# EasyEDA Pro project BLEhound.epro, board blehound
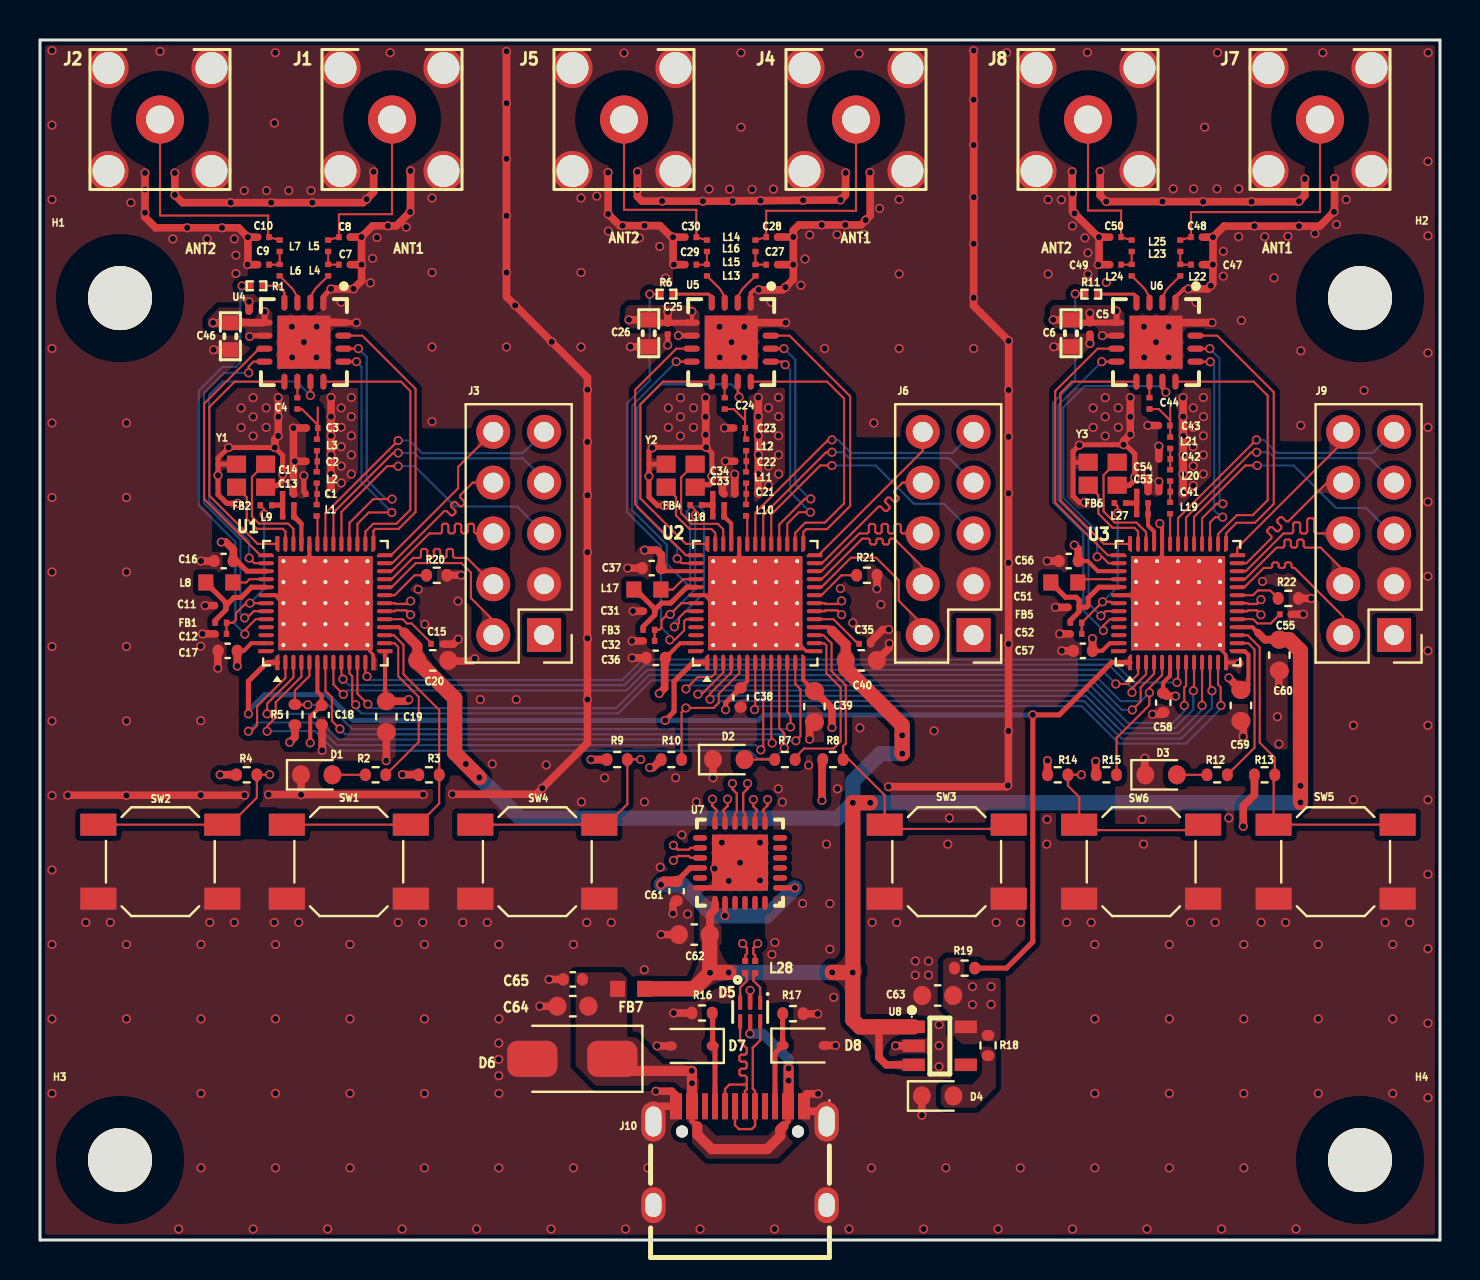
[diagram p1: board, top side]
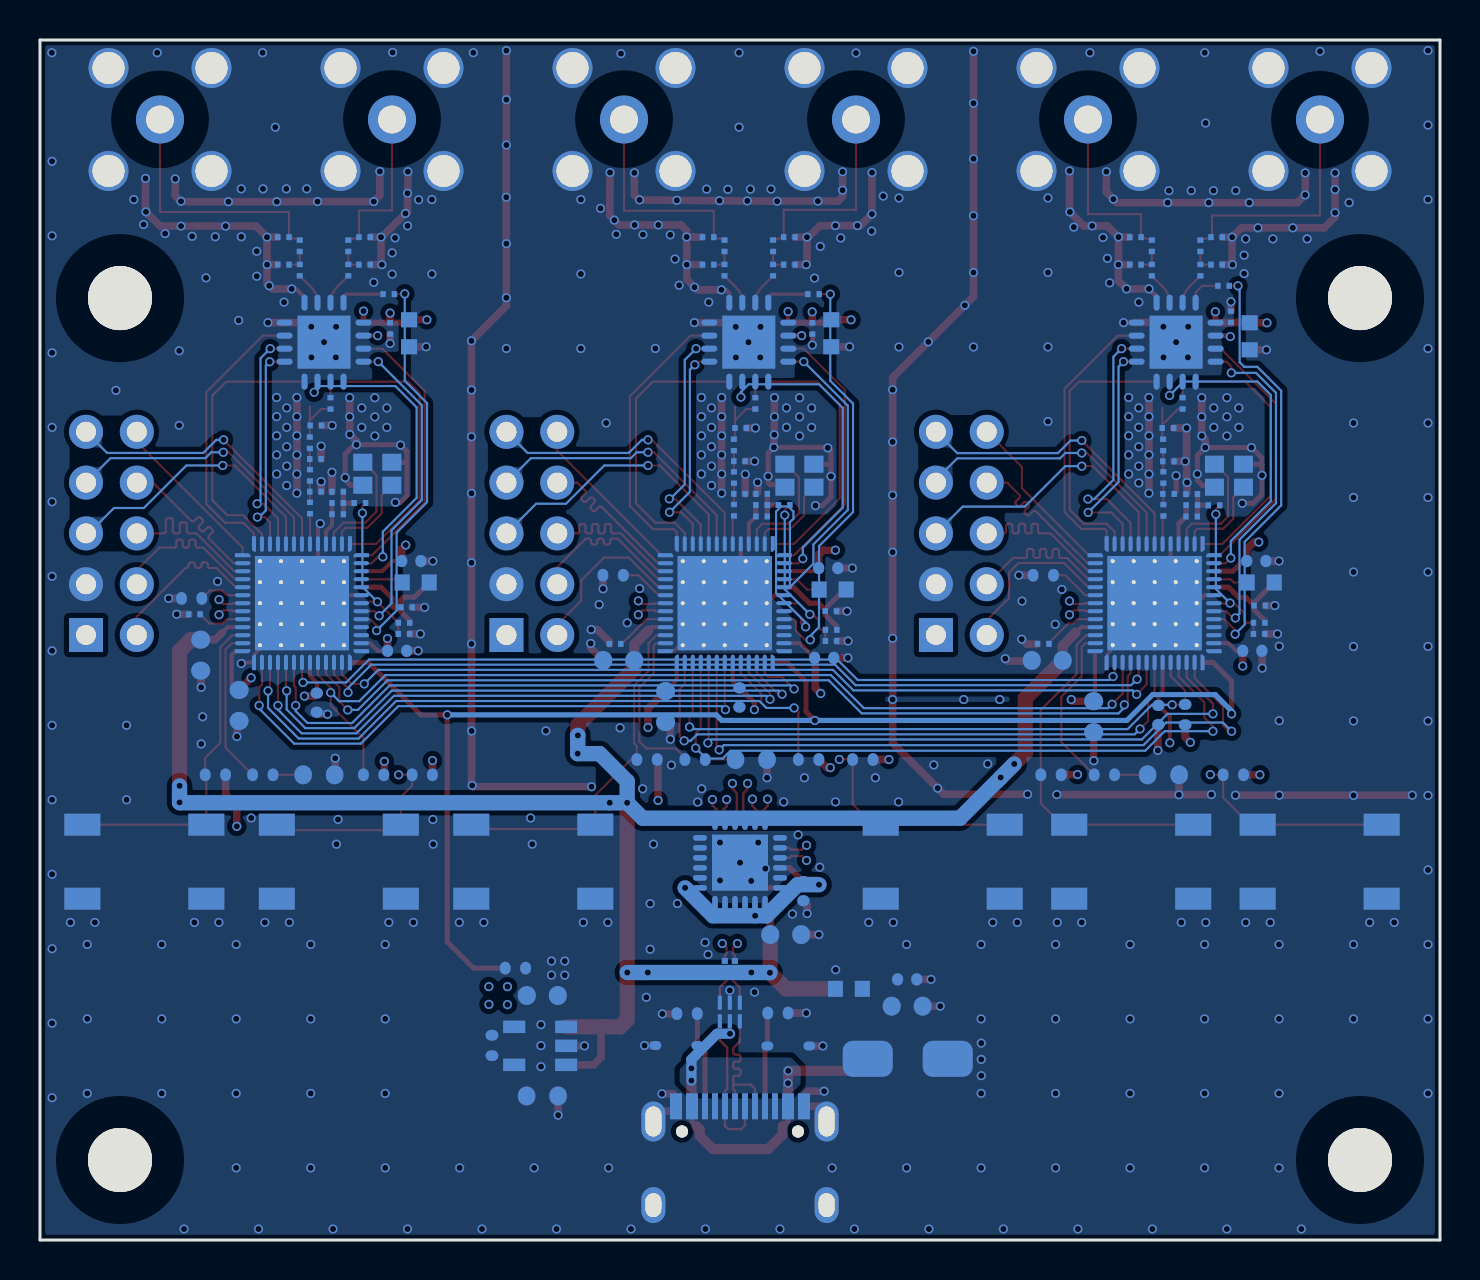
[diagram p2: board, bottom side, seen from below]

Outline 70 x 60 mm; copper layers: Top Layer, GND.Plane, Sig.Mid1, Sig.Mid2, PWR.Plane, Bottom Layer. Coordinates in mm from the lower left corner of the outline.
Outline path: 0,60 70,60 70,0 0,0 0,60
Stack: Top Layer 0.035mm / Bottom Layer 0.035mm

## Design rules (mm)
net FMID1B: 50
net RFO2C: 50
net TRXC: 50
net FANT1B: 50
net FANT2B: 50
net TRXB: 50
net FANT1C: 50
net FMID1C: 50
net TRXA: 50
net RFO1A: 50
net RFO1B: 50
net RFO2A: 50
net RFO2B: 50
net RFO1C: 50
net FANT2C: 50
net FMID2B: 50
net FANT1A: 50
net FMID1A: 50
net FANT2A: 50
net FMID2A: 50
net FMID2C: 50
net GND: PWR
net +3V3: PWR
net ANT3C: 50
net ANT4C: 50
net ANT2C: 50
net ANT2A: 50
net ANT3A: 50
net USB_ESD_DP: 90, DP6
net USB_ESD_DM: 90, DP6
net USB_CON_DM: 90, DP5
net USB_CON_DP: 90, DP5
net ANT4B: 50
net +5V: PWR
net ANT2B: 50
net ANT3B: 50
net ANT4A: 50
net TCLKC: TCLK
net ANT1C: 50
net TCLKB: TCLK
net ANT1A: 50
net USBC_DP: 90, DP3
net USBC_DM: 90, DP3
net ANT1B: 50
net USB_UP_DP: 90, DP4
net USB_UP_DM: 90, DP4
net USBA_DP: 90, DP1
net USBA_DM: 90, DP1
net TCLKA: TCLK
net TD0A: TD
net TD1A: TD
net TD2A: TD
net TD3A: TD
net USBB_DP: 90, DP2
net USBB_DM: 90, DP2
spacing copperThickness1oz (default): track to track 0.152, other pairs 0.152 to 0.3
track width copperThickness1oz (default): min 0.102, default 0.107, max 2.54
track width PWR: min 0.127, default 0.381, max 2.54
differential pair 9: width min 0.127, default 2.54, max 2.54; gap min 0.127, default 0.152
differential pair 90 (default): width min 0.102, default 0.117, max 2.54; gap min 0.152, default 0.203
net +3V3 uses PWR, copperRegion
net +5V uses PWR, copperRegion
net GND uses PWR, copperRegion
net class PWR uses PWR
net VBUS_CON uses copperRegion
net PWRLED uses copperRegion

## Placement (name value [footprint] x y rotation side)
C1  1.2pF  [nRF54LM20A:DK_C_0201_0603Metric]  13.57 37.3 180 top
C2  1.5pF  [nRF54LM20A:DK_C_0201_0603Metric]  13.58 38.93 180 top
C3  0.3pF  [nRF54LM20A:DK_C_0201_0603Metric]  13.6 40.6 180 top
C4  1.0pF  [nRF54LM20A:DK_C_0201_0603Metric]  12.87 41.83 90 top
C5  100nF  [nRF54LM20A:DK_C_0201_0603Metric]  52.5 45.58 270 top
C6  10uF  [nRF54LM20A:DK_C_0402_1005Metric]  51.55 45.34 270 top
C7  2.0pF  [nRF54LM20A:DK_C_0201_0603Metric]  15.23 48.77 180 top
C8  1.0pF  [nRF54LM20A:DK_C_0201_0603Metric]  15.23 50.14 180 top
C9  2.0pF  [nRF54LM20A:DK_C_0201_0603Metric]  11.17 48.77 0 top
C10  1.0pF  [nRF54LM20A:DK_C_0201_0603Metric]  11.17 50.14 0 top
C11  4.7uF  [nRF54LM20A:DK_C_0201_0603Metric]  9.01 31.72 180 top
C12  2.2uF  [nRF54LM20A:DK_C_0201_0603Metric]  9.04 30.3 180 top
C13  1.0pF  [nRF54LM20A:DK_C_0201_0603Metric]  12.41 36.74 180 top
C14  2.2uF  [nRF54LM20A:DK_C_0201_0603Metric]  12.41 37.3 0 top
C15  2.2uF  [nRF54LM20A:DK_C_0201_0603Metric]  19.84 29.81 0 top
C16  100nF  [Capacitor_SMD:C_0402_1005Metric]  9.18 33.95 180 top
C17  100nF  [Capacitor_SMD:C_0402_1005Metric]  9.39 29.46 180 top
C18  100nF  [Capacitor_SMD:C_0402_1005Metric]  14.08 26.25 270 top
C19  10uF  [Capacitor_SMD:C_0603_1608Metric]  17.32 26.16 270 top
C20  4.7uF  [Capacitor_SMD:C_0603_1608Metric]  19.64 28.98 0 top
C21  1.2pF  [nRF54LM20A:DK_C_0201_0603Metric]  35.03 37.31 180 top
C22  1.5pF  [nRF54LM20A:DK_C_0201_0603Metric]  35.03 38.94 180 top
C23  0.3pF  [nRF54LM20A:DK_C_0201_0603Metric]  34.97 40.6 180 top
C24  1.0pF  [nRF54LM20A:DK_C_0201_0603Metric]  34.24 41.83 90 top
C25  100nF  [nRF54LM20A:DK_C_0201_0603Metric]  31.38 45.58 270 top
C26  10uF  [nRF54LM20A:DK_C_0402_1005Metric]  30.44 45.34 270 top
C27  2.0pF  [nRF54LM20A:DK_C_0201_0603Metric]  36.59 48.77 180 top
C28  1.0pF  [nRF54LM20A:DK_C_0201_0603Metric]  36.59 50.14 180 top
C29  2.0pF  [nRF54LM20A:DK_C_0201_0603Metric]  32.53 48.77 0 top
C30  1.0pF  [nRF54LM20A:DK_C_0201_0603Metric]  32.53 50.14 0 top
C31  4.7uF  [nRF54LM20A:DK_C_0201_0603Metric]  30.45 31.44 180 top
C32  2.2uF  [nRF54LM20A:DK_C_0201_0603Metric]  30.44 29.95 180 top
C33  1.0pF  [nRF54LM20A:DK_C_0201_0603Metric]  33.92 36.75 180 top
C34  2.2uF  [nRF54LM20A:DK_C_0201_0603Metric]  33.92 37.31 0 top
C35  2.2uF  [nRF54LM20A:DK_C_0201_0603Metric]  41.24 29.81 0 top
C36  100nF  [Capacitor_SMD:C_0402_1005Metric]  30.79 29.11 180 top
C37  100nF  [Capacitor_SMD:C_0402_1005Metric]  30.59 33.6 180 top
C38  100nF  [Capacitor_SMD:C_0402_1005Metric]  35.03 27.13 270 top
C39  10uF  [Capacitor_SMD:C_0603_1608Metric]  38.72 26.67 270 top
C40  4.7uF  [Capacitor_SMD:C_0603_1608Metric]  41.06 28.98 0 top
C41  1.2pF  [nRF54LM20A:DK_C_0201_0603Metric]  56.23 37.42 180 top
C42  1.5pF  [nRF54LM20A:DK_C_0201_0603Metric]  56.23 39.05 180 top
C43  0.3pF  [nRF54LM20A:DK_C_0201_0603Metric]  56.21 40.73 180 top
C44  1.0pF  [nRF54LM20A:DK_C_0201_0603Metric]  55.47 41.83 90 top
C45  100nF  [nRF54LM20A:DK_C_0201_0603Metric]  10.45 46.16 90 top
C46  10uF  [nRF54LM20A:DK_C_0402_1005Metric]  9.52 45.19 270 top
C47  2.0pF  [nRF54LM20A:DK_C_0201_0603Metric]  57.83 48.77 180 top
C48  1.0pF  [nRF54LM20A:DK_C_0201_0603Metric]  57.83 50.14 180 top
C49  2.0pF  [nRF54LM20A:DK_C_0201_0603Metric]  53.77 48.77 0 top
C50  1.0pF  [nRF54LM20A:DK_C_0201_0603Metric]  53.77 50.14 0 top
C51  4.7uF  [nRF54LM20A:DK_C_0201_0603Metric]  51.67 31.64 180 top
C52  2.2uF  [nRF54LM20A:DK_C_0201_0603Metric]  51.8 30.3 180 top
C53  1.0pF  [nRF54LM20A:DK_C_0201_0603Metric]  55.12 36.85 180 top
C54  2.2uF  [nRF54LM20A:DK_C_0201_0603Metric]  55.12 37.41 0 top
C55  2.2uF  [nRF54LM20A:DK_C_0201_0603Metric]  62.28 31.29 0 top
C56  100nF  [Capacitor_SMD:C_0402_1005Metric]  51.43 33.95 180 top
C57  100nF  [Capacitor_SMD:C_0402_1005Metric]  52.14 29.46 180 top
C58  100nF  [Capacitor_SMD:C_0402_1005Metric]  56.16 26.87 270 top
C59  10uF  [Capacitor_SMD:C_0603_1608Metric]  60.04 26.73 270 top
C60  4.7uF  [Capacitor_SMD:C_0603_1608Metric]  61.97 29.24 270 top
C61  1uF  [Capacitor_SMD:C_0402_1005Metric]  31.83 17.44 270 top
C62  1uF  [Capacitor_SMD:C_0603_1608Metric]  32.71 15.27 180 top
C63  10uF  [Capacitor_SMD:C_0603_1608Metric]  44.88 12.22 180 top
C64  1uF  [Capacitor_SMD:C_0603_1608Metric]  26.64 11.69 180 top
C65  100nF  [Capacitor_SMD:C_0402_1005Metric]  26.64 13.03 180 top
D1  GREEN  [LED_SMD:LED_0603_1608Metric]  13.83 23.26 0 top
D2  GREEN  [LED_SMD:LED_0603_1608Metric]  34.44 24.02 0 top
D3  GREEN  [LED_SMD:LED_0603_1608Metric]  56.06 23.26 0 top
D4  PWR  [LED_SMD:LED_0603_1608Metric]  44.88 7.2 0 top
D5  PRTR5V0U2F  [nordic:SON50P100X50-6N]  35.51 11.4 270 top
D6  SMAJ5.0A  [Diode_SMD:D_SMA]  26.61 9.06 180 top
D7  PESD5V0S1BA  [Diode_SMD:D_SOD-323]  32.58 9.7 180 top
D8  PESD5V0S1BA  [Diode_SMD:D_SOD-323]  38.18 9.72 0 top
FB1  120R  [nRF54LM20A:DK_L_0201_0603Metric]  9.04 30.86 0 top
FB2  15nH  [nRF54LM20A:DK_L_0201_0603Metric]  11.3 36.73 0 top
FB3  120R  [nRF54LM20A:DK_L_0201_0603Metric]  30.44 30.51 0 top
FB4  15nH  [nRF54LM20A:DK_L_0201_0603Metric]  32.79 36.75 0 top
FB5  120R  [nRF54LM20A:DK_L_0201_0603Metric]  51.8 30.86 0 top
FB6  15nH  [nRF54LM20A:DK_L_0201_0603Metric]  54.01 36.85 0 top
FB7  120R/3A  [nordic:INDC1608X06L]  29.56 12.56 0 top
H1  M3  [MountingHole_3.2mm_M3]  4 47.09 0 top
H2  M3  [MountingHole_3.2mm_M3]  66 47.09 0 top
H3  M3  [MountingHole_3.2mm_M3]  4 4 0 top
H4  M3  [MountingHole_3.2mm_M3]  66 4 0 top
J1  PCB.SMAFRA.HT  [nordic:SMA_RA_TH_Taoglas]  17.6 56.03 0 top
J2  PCB.SMAFRA.HT  [nordic:SMA_RA_TH_Taoglas]  6 56.03 0 top
J3  SWD+ETM ch37  [Connector_PinHeader_2.54mm:PinHeader_2x05_P2.54mm_Vertical]  25.2 30.25 180 top
J4  PCB.SMAFRA.HT  [nordic:SMA_RA_TH_Taoglas]  40.8 56.03 0 top
J5  PCB.SMAFRA.HT  [nordic:SMA_RA_TH_Taoglas]  29.2 56.03 0 top
J6  SWD+ETM ch38  [Connector_PinHeader_2.54mm:PinHeader_2x05_P2.54mm_Vertical]  46.68 30.25 180 top
J7  PCB.SMAFRA.HT  [nordic:SMA_RA_TH_Taoglas]  64 56.03 0 top
J8  PCB.SMAFRA.HT  [nordic:SMA_RA_TH_Taoglas]  52.4 56.03 0 top
J9  SWD+ETM ch39  [Connector_PinHeader_2.54mm:PinHeader_2x05_P2.54mm_Vertical]  67.7 30.25 180 top
J10  USB-C  [ext:USB-C_SMD-TYPE-C-31-M-12_1]  35 4.22 0 top
L1  3.6nH  [nRF54LM20A:DK_L_0201_0603Metric]  13.83 36.49 90 top
L2  4.7nH  [nRF54LM20A:DK_L_0201_0603Metric]  13.83 38.12 90 top
L3  3.3nH  [nRF54LM20A:DK_L_0201_0603Metric]  13.84 39.75 90 top
L4  1.9nH  [nRF54LM20A:DK_L_0201_0603Metric]  14.41 48.49 90 top
L5  3.0nH  [nRF54LM20A:DK_L_0201_0603Metric]  14.41 49.71 90 top
L6  1.9nH  [nRF54LM20A:DK_L_0201_0603Metric]  11.98 48.49 90 top
L7  3.0nH  [nRF54LM20A:DK_L_0201_0603Metric]  11.98 49.71 90 top
L8  4.7uH  [nRF54LM20A:DK_L_0603_1608Metric]  8.96 32.88 180 top
L9  1.0nH  [nRF54LM20A:DK_L_0201_0603Metric]  12.42 36.18 0 top
L10  3.6nH  [nRF54LM20A:DK_L_0201_0603Metric]  35.3 36.49 90 top
L11  4.7nH  [nRF54LM20A:DK_L_0201_0603Metric]  35.3 38.12 90 top
L12  3.3nH  [nRF54LM20A:DK_L_0201_0603Metric]  35.31 39.75 90 top
L13  1.9nH  [nRF54LM20A:DK_L_0201_0603Metric]  35.77 48.49 90 top
L14  3.0nH  [nRF54LM20A:DK_L_0201_0603Metric]  35.77 49.71 90 top
L15  1.9nH  [nRF54LM20A:DK_L_0201_0603Metric]  33.35 48.49 90 top
L16  3.0nH  [nRF54LM20A:DK_L_0201_0603Metric]  33.35 49.71 90 top
L17  4.7uH  [nRF54LM20A:DK_L_0603_1608Metric]  30.37 32.52 180 top
L18  1.0nH  [nRF54LM20A:DK_L_0201_0603Metric]  33.92 36.18 0 top
L19  3.6nH  [nRF54LM20A:DK_L_0201_0603Metric]  56.5 36.6 90 top
L20  4.7nH  [nRF54LM20A:DK_L_0201_0603Metric]  56.5 38.23 90 top
L21  3.3nH  [nRF54LM20A:DK_L_0201_0603Metric]  56.51 39.86 90 top
L22  1.9nH  [nRF54LM20A:DK_L_0201_0603Metric]  57.01 48.49 90 top
L23  3.0nH  [nRF54LM20A:DK_L_0201_0603Metric]  57.01 49.71 90 top
L24  1.9nH  [nRF54LM20A:DK_L_0201_0603Metric]  54.58 48.49 90 top
L25  3.0nH  [nRF54LM20A:DK_L_0201_0603Metric]  54.58 49.71 90 top
L26  4.7uH  [nRF54LM20A:DK_L_0603_1608Metric]  51.22 32.88 180 top
L27  1.0nH  [nRF54LM20A:DK_L_0201_0603Metric]  55.12 36.29 0 top
L28  DLM0NSM900HY2D  [nordic:CMC0806X05N]  35.51 13.65 0 top
R1  33k  [nRF54LM20A:DK_R_0201_0603Metric]  10.82 47.71 0 top
R2  1k  [Resistor_SMD:R_0402_1005Metric]  16.78 23.26 180 top
R3  10k  [Resistor_SMD:R_0402_1005Metric]  19.45 23.26 0 top
R4  10k  [Resistor_SMD:R_0402_1005Metric]  10.33 23.26 0 top
R5  10k  [Resistor_SMD:R_0402_1005Metric]  12.74 26.27 90 top
R6  33k  [nRF54LM20A:DK_R_0201_0603Metric]  31.32 47.29 0 top
R7  1k  [Resistor_SMD:R_0402_1005Metric]  37.25 24.02 180 top
R8  10k  [Resistor_SMD:R_0402_1005Metric]  39.65 24.02 0 top
R9  10k  [Resistor_SMD:R_0402_1005Metric]  28.86 24.02 0 top
R10  10k  [Resistor_SMD:R_0402_1005Metric]  31.57 24.02 0 top
R11  33k  [nRF54LM20A:DK_R_0201_0603Metric]  52.56 47.29 0 top
R12  1k  [Resistor_SMD:R_0402_1005Metric]  58.86 23.26 180 top
R13  10k  [Resistor_SMD:R_0402_1005Metric]  61.23 23.26 0 top
R14  10k  [Resistor_SMD:R_0402_1005Metric]  50.89 23.26 0 top
R15  10k  [Resistor_SMD:R_0402_1005Metric]  53.32 23.26 0 top
R16  5.1k  [Resistor_SMD:R_0402_1005Metric]  33.1 11.35 180 top
R17  5.1k  [Resistor_SMD:R_0402_1005Metric]  37.65 11.32 0 top
R18  1k  [Resistor_SMD:R_0402_1005Metric]  47.4 9.73 270 top
R19  4.7k  [Resistor_SMD:R_0402_1005Metric]  46.23 13.59 0 top
R20  200R  [Resistor_SMD:R_0402_1005Metric]  19.84 33.24 0 top
R21  200R  [Resistor_SMD:R_0402_1005Metric]  41.34 33.24 0 top
R22  200R  [Resistor_SMD:R_0402_1005Metric]  62.42 32.08 0 top
SW1  BOOT  [Button_Switch_SMD:SW_SPST_SKQG_WithoutStem]  15.44 18.92 0 top
SW2  RESET  [Button_Switch_SMD:SW_SPST_SKQG_WithoutStem]  6.02 18.92 0 top
SW3  BOOT  [Button_Switch_SMD:SW_SPST_SKQG_WithoutStem]  45.34 18.92 0 top
SW4  RESET  [Button_Switch_SMD:SW_SPST_SKQG_WithoutStem]  24.86 18.92 0 top
SW5  BOOT  [Button_Switch_SMD:SW_SPST_SKQG_WithoutStem]  64.78 18.92 0 top
SW6  RESET  [Button_Switch_SMD:SW_SPST_SKQG_WithoutStem]  55.06 18.92 0 top
U1  nRF54LM20A ch37  [nRF54LM20A:nRF54LM20A_QFN52_6x6mm_P0.4mm_EP4.7x4.7mm]  14.27 31.84 90 top
U2  nRF54LM20A ch38  [nRF54LM20A:nRF54LM20A_QFN52_6x6mm_P0.4mm_EP4.7x4.7mm]  35.76 31.84 90 top
U3  nRF54LM20A ch39  [nRF54LM20A:nRF54LM20A_QFN52_6x6mm_P0.4mm_EP4.7x4.7mm]  56.9 31.84 90 top
U4  nRF21540-QDAA  [nRF54LM20A:nRF21540_QFN16_4x4mm_P0.65mm_EP2.65]  13.19 44.89 270 top
U5  nRF21540-QDAA  [nRF54LM20A:nRF21540_QFN16_4x4mm_P0.65mm_EP2.65]  34.56 44.89 270 top
U6  nRF21540-QDAA  [nRF54LM20A:nRF21540_QFN16_4x4mm_P0.65mm_EP2.65]  55.8 44.89 270 top
U7  CH334F  [ext:QFN-24_L4.0-W4.0-P0.50-BL-EP2.8]  35 18.86 90 top
U8  AP2112K-3.3  [ext:SOT-25-5_L2.9-W1.6-P0.95-LS2.8-BL]  44.99 9.71 270 top
Y1  32MHz  [nRF54LM20A:DK_Crystal_32MHz]  10.55 38.22 180 top
Y2  32MHz  [nRF54LM20A:DK_Crystal_32MHz]  32.03 38.22 180 top
Y3  32MHz  [nRF54LM20A:DK_Crystal_32MHz]  53.13 38.31 180 top

## Footprints (pads in the part's own frame, mm; a bottom-side part is the same pattern mirrored in y, then rotated)
Button_Switch_SMD:SW_SPST_SKQG_WithoutStem
  rect 1.8x1.1 hole 0.001: 1(-3.1,1.85) 1(3.1,1.85) 2(-3.1,-1.85) 2(3.1,-1.85)
Capacitor_SMD:C_0402_1005Metric
  rrect 0.56x0.62 hole 0.001: 1(-0.48,0) 2(0.48,0)
Capacitor_SMD:C_0603_1608Metric
  rrect 0.9x0.95 hole 0.001: 1(-0.775,0) 2(0.775,0)
Connector_PinHeader_2.54mm:PinHeader_2x05_P2.54mm_Vertical
  rect 1.7x1.7 hole 1: 1(0,0)
  round 1.7 hole 1: 2(2.54,0) 3(0,-2.54) 4(2.54,-2.54) 5(0,-5.08) 6(2.54,-5.08) 7(0,-7.62) 8(2.54,-7.62) 9(0,-10.16) 10(2.54,-10.16)
Diode_SMD:D_SMA
  rrect 2.5x1.8 hole 0.001: 1(-2,0) 2(2,0)
Diode_SMD:D_SOD-323
  rrect 0.6x0.45 hole 0.001: 1(-1.05,0) 2(1.05,0)
ext:QFN-24_L4.0-W4.0-P0.50-BL-EP2.8
  oval 0.28x0.7 hole 0.001: 1(-1.25,-2) 2(-0.75,-2) 3(-0.25,-2) 4(0.25,-2) 5(0.75,-2) 6(1.25,-2) 13(1.25,2) 14(0.75,2) 15(0.25,2) 16(-0.25,2) 17(-0.75,2) 18(-1.25,2)
  oval 0.7x0.28 hole 0.001: 7(2,-1.25) 8(2,-0.75) 9(2,-0.25) 10(2,0.25) 11(2,0.75) 12(2,1.25) 19(-2,1.25) 20(-2,0.75) 21(-2,0.25) 22(-2,-0.25) 23(-2,-0.75) 24(-2,-1.25)
  rect 2.8x2.8 hole 0.001: 25(0.01,0)
ext:SOT-25-5_L2.9-W1.6-P0.95-LS2.8-BL
  rect 0.622x1.105 hole 0.001: 1(-0.95,-1.3) 2(0,-1.3) 3(0.95,-1.3) 4(0.95,1.3) 5(-0.95,1.3)
ext:USB-C_SMD-TYPE-C-31-M-12_1
  round 0.6 hole 0.6: (-2.9,1.21) (2.9,1.21)
  oval 1.2x2 hole 0.8x1.5: 1(4.33,1.71) 4(-4.33,1.71)
  oval 1.2x1.8 hole 0.8x1.2: 2(4.33,-2.47) 3(-4.33,-2.47)
  custom 0.6x1.3 hole 0.001: A1B12(-3.2,2.47) A4B9(-2.4,2.47) B1A12(3.2,2.47) B4A9(2.4,2.47)
  rect 0.3x1.3 hole 0.001: A5(-1.25,2.47) A6(-0.25,2.47) A7(0.25,2.47) A8(1.25,2.47) B5(1.75,2.47) B6(0.75,2.47) B7(-0.75,2.47) B8(-1.75,2.47)
LED_SMD:LED_0603_1608Metric
  rrect 0.875x0.95 hole 0.001: 1(-0.787,0) 2(0.787,0)
MountingHole_3.2mm_M3
  round 3.2 hole 3.2: (0,0)
nordic:CMC0806X05N
  rect 0.3x0.3 hole 0.001: 1(-0.25,-0.3) 2(0.25,-0.3) 3(0.25,0.3) 4(-0.25,0.3)
nordic:INDC1608X06L
  rect 0.75x0.8 hole 0.001: 1(-0.675,0) 2(0.675,0)
nordic:SMA_RA_TH_Taoglas
  round 2.4 hole 1.4: 1(0,0)
  round 2 hole 1.6: 2(-2.575,2.575) 2(-2.575,-2.575) 2(2.575,2.575) 2(2.575,-2.575)
nordic:SON50P100X50-6N
  rect 0.7x0.2 hole 0.001: 1(-0.465,0.5) 2(-0.465,0) 3(-0.465,-0.5) 4(0.465,-0.5) 5(0.465,0) 6(0.465,0.5)
nRF54LM20A:DK_C_0201_0603Metric
  rect 0.27x0.3 hole 0.001: 1(-0.285,0) 2(0.285,0)
nRF54LM20A:DK_C_0402_1005Metric
  rect 0.75x0.8 hole 0.001: 1(-0.675,0) 2(0.675,0)
nRF54LM20A:DK_Crystal_32MHz
  rect 0.95x0.85 hole 0.001: 1(-0.725,-0.575) 2(0.725,-0.575) 3(0.725,0.575) 4(-0.725,0.575)
nRF54LM20A:DK_L_0201_0603Metric
  rect 0.27x0.3 hole 0.001: 1(-0.285,0) 2(0.285,0)
nRF54LM20A:DK_L_0603_1608Metric
  rect 0.75x0.8 hole 0.001: 1(-0.675,0) 2(0.675,0)
nRF54LM20A:DK_R_0201_0603Metric
  rect 0.27x0.3 hole 0.001: 1(-0.285,0) 2(0.285,0)
nRF54LM20A:nRF54LM20A_QFN52_6x6mm_P0.4mm_EP4.7x4.7mm
  custom 0.775x0.2 hole 0.001: 1(-2.962,2.4) 13(-2.962,-2.4) 27(2.962,-2.4) 39(2.962,2.4)
  rrect 0.775x0.2 hole 0.001: 2(-2.962,2) 3(-2.962,1.6) 4(-2.962,1.2) 5(-2.962,0.8) 6(-2.962,0.4) 7(-2.962,0) 8(-2.962,-0.4) 9(-2.962,-0.8) 10(-2.962,-1.2) 11(-2.962,-1.6) 12(-2.962,-2) 28(2.962,-2) 29(2.962,-1.6) 30(2.962,-1.2) 31(2.962,-0.8) 32(2.962,-0.4) 33(2.962,0) 34(2.962,0.4) 35(2.962,0.8) 36(2.962,1.2) 37(2.962,1.6) 38(2.962,2)
  custom 0.2x0.775 hole 0.001: 14(-2.4,-2.962) 26(2.4,-2.962) 40(2.4,2.962) 52(-2.4,2.962)
  rrect 0.2x0.775 hole 0.001: 15(-2,-2.962) 16(-1.6,-2.962) 17(-1.2,-2.962) 18(-0.8,-2.962) 19(-0.4,-2.962) 20(0,-2.962) 21(0.4,-2.962) 22(0.8,-2.962) 23(1.2,-2.962) 24(1.6,-2.962) 25(2,-2.962) 41(2,2.962) 42(1.6,2.962) 43(1.2,2.962) 44(0.8,2.962) 45(0.4,2.962) 46(0,2.962) 47(-0.4,2.962) 48(-0.8,2.962) 49(-1.2,2.962) 50(-1.6,2.962) 51(-2,2.962)
  round 0.5 hole 0.2: 53(-2.1,2.1) 53(-2.1,1.05) 53(-2.1,0) 53(-2.1,-1.05) 53(-2.1,-2.1) 53(-1.05,2.1) 53(-1.05,1.05) 53(-1.05,0) 53(-1.05,-1.05) 53(-1.05,-2.1) 53(0,2.1) 53(0,1.05) 53(0,0) 53(0,-1.05) 53(0,-2.1) 53(1.05,2.1) 53(1.05,1.05) 53(1.05,0) 53(1.05,-1.05) 53(1.05,-2.1) 53(2.1,2.1) 53(2.1,1.05) 53(2.1,0) 53(2.1,-1.05) 53(2.1,-2.1)
  rect 4.7x4.7 hole 0.001: 53(0,0) 53(0,0)
nRF54LM20A:nRF21540_QFN16_4x4mm_P0.65mm_EP2.65
  oval 0.8x0.3 hole 0.001: 1(-1.975,0.975) 2(-1.975,0.325) 3(-1.975,-0.325) 4(-1.975,-0.975) 9(1.975,-0.975) 10(1.975,-0.325) 11(1.975,0.325) 12(1.975,0.975)
  oval 0.3x0.8 hole 0.001: 5(-0.975,-1.975) 6(-0.325,-1.975) 7(0.325,-1.975) 8(0.975,-1.975) 13(0.975,1.975) 14(0.325,1.975) 15(-0.325,1.975) 16(-0.975,1.975)
  rect 2.65x2.65 hole 0.001: 17(0,0)
Resistor_SMD:R_0402_1005Metric
  rrect 0.54x0.64 hole 0.001: 1(-0.51,0) 2(0.51,0)

## Nets
As in the schematic.

Pads without a net: J10 A8 B8; U1 49 50 52; U2 49 50 52; U3 49 50 52; U7 2 3 4 5 6 13 17 21 22 23 24; U8 4

## Via types
v1: diameter 0.457, hole 0.305, Top Layer to Bottom Layer, 691 vias

## Routing (per net, layer and track width the routed paths; a pad name or vN(x,y) marks a point on that pad's centre or on a via; arc(x,y) is an arc through that point)
+3V3: length 62.7
  Top Layer w0.203: U3.51 53.49,29.84 53.11,29.46 C57.1 ; U2.13 38.16,28.01 C39.1 ; C37.1 31.22,33.44 U2.42 ; U1.51 10.57,29.84 10.19,29.46 9.86,29.46 ; v1(32.59,46.42) 32.6,46.41 32.6,45.89 U5.5 ; v1(13.51,24.86) 13.51,26.16 14.07,26.73 C18.1 14.08,27.21 13.87,27.42 U1.6 ; U3.6 56.5,28.21 56.16,27.86 56.16,27.36 ; U2.51 32,29.84 C36.1 ; C59.1 60.21,27.5 60.42,27.71 60.42,29.26 60.24,29.44 U3.14 ; C56.1 52.39,33.95 52.9,33.44 U3.42 ; 17.25,29.44 17.25,27 C19.1 ; U2.6 35.36,27.94 C38.1 ; U6.6 v1(53.12,45.22)
  Top Layer w0.254: U1.42 10.35,33.44 9.85,33.95 C16.1 ; C38.1 34.28,26.86 v1(34.28,26.52) ; v1(10.49,45.17) 10.53,45.22 U4.6 ; U5.6 v1(31.92,45.22)
  Top Layer w0.305: C26.1 30.58,45.87 U5.5 ; v1(11.23,46.41) 11.23,45.88 U4.5 ; v1(53.82,46.45) U6.5 51.69,45.87 C6.1
  Top Layer w0.381: v1(60.16,20.68) 60.16,21.7 60.72,22.26 60.72,23.26 ; C56.1 51.91,34.55 v1(51.71,34.75) ; U4.5 10.45,45.87 ; C5.1 v1(52.5,46.35) ; v1(39.6,25.63) 39.6,26.57 C39.1 ; C19.1 18.36,26.94 v1(18.44,27.02) ; C25.1 31.38,45.87 31.39,45.87 v1(31.39,46.4) ; v1(30.23,34.49) 30.84,34.49 31.07,34.27 C37.1 ; v1(39.1,21.98) 39.1,23.98 R8.1 ; v1(59.44,28.11) 59.44,28.1 C59.1 ; v1(30.49,23.62) 30.65,23.62 31.06,24.02 ; R5.1 12.74,25.14 v1(12.48,24.88) ; R14.1 v1(50.38,23.97) ; v1(30.96,27.33) 31.23,27.59 31.23,29.07 C36.1 ; v1(56.78,27.19) 56.32,27.19 C58.1 ; C6.1 v1(50.66,46.01) ; R15.1 52.78,23.28 v1(52.78,23.93) ; C26.1 v1(29.45,46.01) ; R4.1 v1(9.01,23.26) ; 52.63,29.46 v1(52.63,30.07) ; v1(18.12,23.27) 18.93,23.27 R3.1 ; v1(8.65,45.86) C46.1 9.53,45.88 C45.1 ; v1(9.06,34.9) 9.29,34.9 9.66,34.53 C16.1 ; R9.1 v1(27.55,24.02) ; 9.86,29.46 v1(9.86,28.7)
  vias: v1(46.63,12.67) v1(46.63,11.77) v1(47.55,12.67) v1(47.55,11.78)
+5V: length 113.4
  Top Layer w0.203: 60.89,30.37 60.62,30.64 U3.17 ; 18.22,30.37 17.95,30.64 U1.17 ; U2.17 39.42,30.64 ; 39.6,30.47 39.42,30.64
  Top Layer w0.381: 60.89,30.37 61.24,30.02 C60.1 ; U8.3 42.32,8.76 41.95,9.13 41.95,10.66 ; C62.1 33.49,16.26 33.75,16.53 U7.19
  Top Layer w0.508: C40.1 40.29,29.78 39.6,30.47 ; 18.22,30.37 18.87,29.7 C20.1
  Top Layer w0.762: v1(33.5,13.36) 33.49,13.38 C62.1 ; v1(33.5,13.36) 32.7,12.56 FB7.2 ; v1(33.5,13.36) 33.52,13.38 v1(34.43,13.38) ; v1(41.51,21.86) v1(40.64,21.86) 40.64,13.38 v1(40.64,13.38) ; v1(21.97,23.12) v1(21.29,23.8) 20.74,24.36 20.74,27.08 18.87,28.95 C20.1 ; v1(40.64,13.38) v1(39.61,13.38) ; v1(40.64,13.38) 40.64,11.01 40.99,10.66 U8.1 ; v1(63.02,21.88) v1(63.02,22.71) 63.02,29.45 62.46,30.02 C60.1 ; v1(43.12,24.32) 43.11,24.33 v1(43.11,25.23) 43.11,25.74 40.29,28.56 C40.1
  Bottom Layer w0.762: v1(21.29,23.8) v1(21.97,23.12) 24,21.09 39.87,21.09 v1(40.64,21.86) ; v1(63.02,22.71) v1(63.02,21.88) 63.01,21.86 v1(41.51,21.86) v1(40.64,21.86) ; v1(40.64,21.86) 40.64,22.94 42.02,24.32 v1(43.12,24.32) 43.12,25.22 v1(43.11,25.23) ; v1(33.5,13.36) 33.52,13.38 v1(34.43,13.38) v1(39.61,13.38) v1(40.64,13.38)
GND: length 483.9
  Top Layer w0.152: U2.53 38.01,29.74 38.31,29.44 U2.14 ; U3.13 59.3,29.26 59,29.56 U3.53 ; U1.13 16.67,29.26 16.48,29.45 16.48,29.63 U1.53
  Top Layer w0.203: U3.45 54.64,32.24 54.8,32.08 U3.53 ; U6.1 56.77,47.13 57.2,47.55 v1(57.42,47.55) ; v1(55.99,35.82) 56.1,35.71 U3.35 56.1,34.19 U3.53 ; U1.53 13.47,34.19 U1.35 ; U2.53 33.26,32.24 U2.45 ; U2.35 34.96,34.19 U2.53 ; U3.13 59.88,28.88 v1(59.94,28.83) ; U1.45 11.77,32.24 U1.53 ; 35.51,11.86 v1(35.51,12.48) ; U5.1 35.53,47.34 35.7,47.51 v1(35.93,47.51)
  Top Layer w0.254: C1.2 13.19,37.4 v1(13.19,38.22) ; Y2.4 32.88,37.76 33.49,37.76 33.59,37.87 v1(33.59,38.19) 33.59,39.34 v1(33.31,39.63) 30.64,39.63 v1(30.61,39.61) 30.45,39.44 30.45,38.79 ; 51.65,38.89 51.65,39.43 v1(51.97,39.75) 51.99,39.76 v1(54.18,39.76) 54.28,39.76 54.74,39.3 v1(54.74,38.12) 54.74,38 54.48,37.74 53.86,37.74 ; 51.65,38.89 51.65,37.2 51.97,36.88 v1(52.23,36.88) ; 51.65,38.89 Y3.2 ; v1(14.55,47.55) 14.17,47.17 U4.1 ; 30.45,38.79 v1(30.45,38.18) 30.45,37.15 30.88,36.72 v1(31.23,36.72) ; 30.45,38.79 Y2.2 ; v1(34.44,17.95) 34.09,17.61 U7.18 ; 8.9,38.77 8.9,39.1 v1(9.43,39.62) v1(11.74,39.62) 12.13,39.23 v1(12.13,38.3) 12.13,37.98 11.87,37.72 11.36,37.72 Y1.4 ; 8.9,38.77 8.92,38.79 Y1.2 ; 8.9,38.77 v1(8.9,38.23) 8.9,37.27 9.34,36.83 v1(9.89,36.83) ; v1(15.82,45.87) U4.16 ; C25.2 v1(31.38,44.75)
  Top Layer w0.381: v1(20.62,22.29) 24.81,22.29 v1(25.11,22.59) 27.37,24.85 v1(27.37,27.02) v1(27.37,30.09) v1(27.37,34.39) v1(27.37,37.24) v1(27.37,39.9) v1(27.37,42.51) 27.37,43.12 v1(25.59,44.91) v1(23.76,46.73) 23.33,47.17 v1(23.33,48.38) v1(23.33,51.21) v1(23.33,54.06) v1(23.33,56.84) v1(23.33,59.43) ; C28.1 36.89,50.15 v1(37.67,50.15) ; v1(38.88,11.3) 38.17,11.3 R17.2 ; U8.2 v1(42.78,9.71) ; C60.2 61.94,28.44 v1(61.94,27.63) ; v1(10.23,22.24) v1(8.04,22.24) v1(1.39,22.24) ; v1(14.11,24.48) 14.11,25.74 C18.2 ; 31.65,50.07 31.65,48.81 v1(31.69,48.77) C29.1 ; 31.65,50.07 31,50.72 v1(30.23,50.72) 28.98,50.72 v1(28.4,51.3) 28.4,53.15 28.4,53.15 v1(28.4,53.37) ; 31.65,50.07 v1(31.65,50.14) C30.1 ; v1(14.55,42.13) v1(14.55,41.17) v1(14.55,40.21) v1(14.55,39.25) v1(14.55,38.3) v1(14.55,37.34) ; v1(11.91,42.12) v1(11.91,41.16) v1(11.91,40.2) 11.74,40.03 v1(11.74,39.62) ; v1(29.87,53.41) 29.87,53.41 v1(29.87,52.49) 29.87,52.17 30.1,51.94 v1(31.11,51.94) 33.14,51.94 v1(33.14,51.94) v1(34.63,51.95) v1(36.03,51.97) v1(38.16,51.99) v1(40.02,52) 40.28,52.26 v1(40.28,53.36) ; C57.2 v1(51.09,29.46) ; v1(33.65,23.11) D2.1 33.67,24.02 ; v1(16.68,53.41) 16.68,52.39 v1(16.33,52.04) 16.15,51.87 v1(13.62,51.87) v1(11.56,51.87) v1(9.54,51.87) 7.13,51.87 v1(6.74,52.25) v1(6.74,53.36) ; v1(33.31,39.63) 33.31,40.24 v1(33.29,40.26) 33.29,41.15 v1(33.28,41.16) v1(33.28,42.12) ; v1(46.68,59.47) v1(46.68,57.02) v1(46.68,54.75) 46.68,54.75 v1(46.68,52.14) 46.68,49.82 v1(46.68,49.82) v1(46.68,47.11) 46.68,46.71 v1(48.43,44.96) v1(48.43,42.5) v1(48.43,40.16) v1(48.43,37.34) v1(48.43,33.86) v1(48.43,29.8) 48.43,25.46 v1(48.42,25.45) 48.42,22.76 v1(48.39,22.73) 48.33,22.66 v1(42.42,22.66) ; v1(16.08,48.77) 16.07,48.77 v1(16.07,50.15) ; v1(16.08,48.77) C7.1 ; v1(16.08,48.77) 16.08,47.96 v1(15.67,47.55) v1(14.55,47.55) ; C17.2 8.89,29.44 v1(8.89,28.59) ; C21.2 34.74,37.31 v1(34.74,38.29) ; C34.2 34.12,37.39 v1(34.12,37.88) ; v1(42.44,30.52) 42.14,30.52 41.53,29.91 C35.2 ; v1(58.65,50.14) 59.2,50.69 v1(60.72,50.69) v1(62.95,50.69) 63.99,50.69 v1(64.7,51.41) 64.73,51.43 v1(64.73,53.08) ; v1(58.65,50.14) C48.1 ; v1(58.65,50.14) 58.65,48.77 v1(58.65,48.77) ; C8.1 15.52,50.15 v1(16.07,50.15) ; v1(35.21,45.66) 35.42,45.87 U5.16 v1(37.28,45.87) ; v1(19.16,22.27) 13.05,22.27 ; 13.05,22.27 v1(11.43,22.27) ; 13.05,22.27 v1(13.05,22.26) ; 13.05,22.27 13.05,23.25 D1.1 ; v1(56.44,45.66) 56.64,45.87 U6.16 v1(58.6,45.87) ; C3.2 v1(12.67,40.6) 12.67,37.9 v1(12.65,37.88) 12.65,37.35 C14.2 ; C26.2 v1(29.52,44.66) ; D4.1 v1(44.1,6.24) ; C62.2 v1(31.06,15.27) ; v1(52.95,50.14) 52.95,48.81 v1(52.91,48.77) C49.1 ; v1(52.95,50.14) C50.1 ; v1(52.95,50.14) 52.91,50.14 51.62,51.43 v1(51.62,52.34) 51.61,52.36 v1(51.61,53.42) ; R21.2 41.85,33.23 v1(41.85,32.56) ; v1(21.74,29.07) 21.62,28.95 20.42,28.95 ; v1(16.07,50.15) 16.63,50.7 v1(17.39,50.7) 17.81,50.7 v1(18.51,51.4) 18.52,51.42 v1(18.52,53.46) ; C54.2 v1(55.4,38.39) ; v1(57.42,47.55) 58.38,47.55 58.65,47.82 v1(58.65,48.77) ; v1(53.01,53.43) 53.01,52.23 v1(53.31,51.92) v1(56.12,51.92) 58.15,51.92 v1(58.16,51.91) v1(60.58,51.91) 62.93,51.91 v1(62.95,51.94) 63.24,52.22 v1(63.24,53.05) ; C31.2 v1(29.65,31.44) ; v1(37.67,50.15) 37.67,48.77 v1(37.66,48.77) ; v1(37.67,50.15) 37.67,50.48 37.94,50.75 v1(39.08,50.75) v1(40.27,50.75) 41.04,50.75 v1(41.28,50.99) 41.51,51.22 41.51,52.65 41.5,52.66 v1(41.5,53.38) ; C39.2 38.48,25.66 v1(38.48,25.04) ; v1(55.62,26.29) 56.06,26.29 C58.2 ; v1(35.92,37.34) v1(35.92,38.3) v1(35.92,39.25) v1(35.92,40.21) v1(35.92,41.17) v1(35.92,42.13) ; C9.1 v1(10.38,48.77) 10.39,48.79 v1(10.39,50.14) ; v1(17.31,23.96) 17.32,23.97 17.32,25.39 ; v1(55.24,24.09) 55.24,23.29 D3.1 ; C41.2 v1(55.94,37.92) ; C10.1 v1(10.39,50.14) ; v1(10.39,50.14) 9.93,50.61 v1(9.1,50.61) v1(7.36,50.61) 5.78,50.61 5.25,51.15 v1(5.25,52.53) v1(5.25,53.36) ; v1(57.16,42.13) v1(57.16,41.17) v1(57.16,40.21) v1(57.16,39.25) v1(57.16,38.3) v1(57.16,37.34) ; v1(54.51,42.12) v1(54.51,41.16) 54.51,41.16 v1(54.51,40.28) 54.18,39.94 v1(54.18,39.76) ; C2.2 v1(12.74,38.93) ; v1(35.93,47.51) 37.14,47.51 37.66,48.03 v1(37.66,48.77) ; C43.2 v1(55.39,40.73) ; R16.2 v1(31.69,11.35) ; C42.2 v1(55.94,39.69) ; v1(21.06,33.24) 20.35,33.24 R20.2 ; v1(58.65,48.77) C47.1 ; C61.2 31.65,16.78 v1(31.65,16.32) ; 31.53,9.7 v1(30.86,9.7) ; v1(37.66,48.77) C27.1 ; J10.4 30.67,6.27 31.08,6.69 J10.A1B12 31.8,7.23 31.59,7.44 v1(30.79,7.44) ; C36.2 v1(29.61,29.11) ; C32.2 v1(29.6,29.95) ; 20.16,29.79 20.67,29.79 v1(20.91,30.04) ; v1(13.83,45.66) 14.07,45.9 15.26,45.87 ; C51.2 51.38,31.63 v1(50.77,31.63) ; C37.2 v1(29.38,33.6) ; v1(42.47,29.83) 42.47,29.61 C40.2 ; C22.2 v1(34.27,38.94) ; C11.2 v1(8.26,31.72) ; v1(60.15,25.17) 60.15,25.84 C59.2 ; C64.2 v1(24.99,11.69) ; C56.2 v1(50.36,33.95) ; C12.2 v1(8.12,30.3) ; C55.2 v1(63.17,31.29) ; D8.2 v1(39.78,9.72) ; C16.2 v1(8.05,33.95) ; C6.2 v1(50.69,44.66) ; v1(38.91,7.31) 38.34,7.31 38.2,7.17 J10.B1A12 38.45,6.44 38.82,6.44 J10.1 ; C23.2 v1(34.23,40.6) ; C45.2 v1(10.45,46.91) ; R22.2 v1(63.57,32.08) ; C65.2 v1(25.45,13.03) ; C52.2 v1(50.98,30.3) ; C46.2 v1(8.68,44.51) ; C5.2 v1(52.5,44.83)
  Sig.Mid1 w0.254: v1(36.91,22.56) 40.08,22.56 42.44,24.92 v1(42.44,30.52) 42.44,31.37 v1(42.04,31.77) 41.24,32.57 v1(40.02,32.57) ; v1(40.64,30.86) 40.99,30.5 v1(40.99,25.61) 40.99,25.02 39.71,23.74 v1(38.43,23.74) 38.36,23.67 34.21,23.67 v1(33.65,23.11) v1(31.78,23.11) v1(28.23,23.11) 27.69,23.11 v1(21.74,29.07) 20.9,29.9 v1(20.9,31.95) 20.32,32.53 v1(18.91,32.53) ; v1(32.82,21.9) v1(30.22,21.9) v1(27.07,21.9) 27.07,21.99 v1(25.31,23.75) 25.28,23.75 v1(22.01,27.02) 19.24,29.8 v1(19.24,30.79)
  Sig.Mid1 w0.381: v1(63.17,31.29) 62.38,31.29 61.94,30.85 v1(61.94,27.63) v1(61.94,24.8) 61.94,23.6 v1(59.44,21.1) 58.13,19.79 v1(55.18,19.79) v1(50.34,19.79) v1(45.39,19.79) v1(39.33,19.79) 36.08,19.79 v1(36,19.87) ; v1(36.75,14.88) 36.06,15.56 34.05,15.56 33.67,15.94 33.67,18.51 v1(33.73,18.57) 33.68,18.62 33.68,19.06 32.48,20.26 v1(32.09,20.26) ; v1(37.12,21.9) 37.92,21.1 v1(45.47,21.1) 50.35,21.1 v1(50.35,21.03) v1(55.1,21.03) 57.24,21.03 60.21,24 60.21,32.01 v1(61.12,32.93) ; v1(36.6,14.28) 36.3,13.98 33.16,13.98 32.38,14.76 v1(32.38,16.3) 32.38,17.94 32.14,18.18 31.47,18.18 v1(31.01,18.64)
  vias: v1(0.6,59.47) v1(0.6,55.75) v1(0.6,52.02) v1(0.6,44.57) v1(0.6,40.85) v1(0.6,37.12) v1(0.6,33.4) v1(0.6,29.68) v1(0.6,25.95) v1(0.6,22.23) v1(0.6,18.5) v1(0.6,14.78) v1(0.6,11.05) v1(0.6,7.33) v1(2.29,15.88) v1(3.52,15.88) v1(4.32,40.85) v1(4.32,37.12) v1(4.32,33.4) v1(4.32,29.68) v1(4.32,25.95) v1(4.32,22.23) v1(4.32,14.78) v1(4.32,11.05) v1(4.54,51.87) v1(5.25,51.37) v1(6,59.43) v1(6.64,50.06) v1(6.93,0.55) v1(8.04,29.69) v1(8.04,25.96) v1(8.05,14.78) v1(8.05,11.05) v1(8.05,7.33) v1(8.05,3.61) v1(8.36,50.06) v1(8.49,15.88) v1(9.72,50.06) v1(9.72,15.88) v1(9.8,49.24) v1(9.8,48.32) v1(10.05,41.6) v1(10.05,40.63) v1(10.21,52.47) v1(10.66,42.11) v1(10.66,41.16) v1(10.66,40.2) v1(10.66,0.55) v1(11.33,52.47) v1(11.31,41.61) v1(11.31,40.63) v1(11.72,55.85) v1(11.71,15.88) v1(11.76,59.36) v1(11.77,14.78) v1(11.77,11.05) v1(11.77,7.33) v1(11.77,3.61) v1(12.44,52.47) v1(12.59,45.66) v1(12.61,44.13) v1(12.94,15.88) v1(13.19,44.89) v1(13.55,52.47) v1(13.83,44.13) v1(14.38,0.55) v1(15.06,46.89) v1(15.06,41.61) v1(15.06,40.63) v1(15.06,39.66) v1(15.06,38.69) v1(15.06,37.85) v1(15.5,14.78) v1(15.5,11.05) v1(15.5,7.33) v1(15.5,3.61) v1(15.57,42.13) v1(15.57,41.17) v1(15.57,40.21) v1(15.57,39.25) v1(15.57,38.3) v1(16.52,47.86) v1(16.63,49.08) v1(16.85,50.12) v1(17.5,59.36) v1(17.91,15.88) v1(18.11,0.55) v1(18.31,50.64) v1(19.14,15.88) v1(19.22,14.78) v1(19.22,11.05) v1(19.22,7.33) v1(19.22,3.61) v1(19.6,52.1) v1(19.6,48.38) v1(19.6,44.65) v1(19.6,40.93) v1(21.14,15.88) v1(21.83,0.55) v1(22.36,15.88) v1(22.61,23.8) v1(22.95,14.78) v1(22.95,11.05) v1(22.94,9.85) v1(22.94,9.03) v1(22.94,8.22) v1(22.95,7.33) v1(22.95,3.61) v1(23.33,44.65) v1(23.81,27.02) v1(25.55,0.55) v1(26.67,14.78) v1(26.67,3.61) v1(27.05,52.1) v1(27.05,48.38) v1(27.05,44.65) v1(27.34,15.88) v1(27.84,52.19) v1(28.42,50.44) v1(28.56,15.88) v1(29.13,50.72) v1(29.2,59.35) v1(29.28,0.55) v1(29.96,50.1) v1(30.22,13.51) v1(30.4,3.61) v1(30.99,49.68) v1(31.27,48.1) v1(31.42,41.6) v1(31.42,40.63) v1(32.02,42.11) v1(32.02,41.16) v1(32.02,40.2) v1(32.68,41.61) v1(32.68,40.63) v1(33,0.55) v1(33.45,52.54) v1(33.97,45.66) v1(33.99,44.13) v1(34.09,19.87) v1(34.27,12.39) v1(34.48,52.54) v1(34.58,44.89) v1(35.05,59.36) v1(35.05,55.64) v1(35,18.87) v1(35.21,44.13) v1(35.6,52.53) v1(36,17.98) v1(36.42,41.61) v1(36.42,40.63) v1(36.42,39.66) v1(36.42,38.69) v1(36.42,37.72) v1(36.56,46.89) v1(36.67,52.54) v1(36.73,0.55) v1(36.93,42.13) v1(36.93,41.17) v1(36.93,40.21) v1(36.93,39.25) v1(36.93,38.3) v1(37.27,47.64) v1(38.04,47.74) v1(38.13,16.82) v1(38.25,49.05) v1(38.49,50.26) v1(39.23,44.57) v1(39.49,16.82) v1(39.49,14.54) v1(39.68,12.14) v1(39.85,50.27) v1(39.87,22.56) v1(40.45,0.55) v1(40.95,59.32) v1(41.19,50.28) v1(41.61,15.88) v1(41.57,3.61) v1(41.69,40.85) v1(41.97,51.58) v1(42.83,15.88) v1(42.96,52.02) v1(42.96,48.3) v1(42.96,44.57) v1(43.76,13.95) v1(43.76,13.24) v1(44.18,0.55) v1(44.43,13.95) v1(44.43,13.24) v1(44.7,25.46) v1(44.95,10.77) v1(44.95,9.72) v1(44.95,8.67) v1(45.29,3.61) v1(46.68,44.57) v1(47.81,15.88) v1(47.9,0.55) v1(48.34,59.36) v1(49.03,15.88) v1(49.02,3.61) v1(50.41,52.02) v1(50.41,48.3) v1(51.07,52.01) v1(51.33,15.88) v1(51.62,50.71) v1(51.62,0.55) v1(51.73,51.33) v1(52.25,50.11) v1(52.37,59.38) v1(52.39,49.36) v1(52.39,48.29) v1(52.56,15.88) v1(52.66,41.6) v1(52.66,40.63) v1(52.74,14.78) v1(52.74,11.05) v1(52.74,7.33) v1(52.74,3.61) v1(53.31,47.88) v1(53.26,42.11) v1(53.26,41.16) v1(53.26,40.2) v1(53.91,41.61) v1(53.91,40.63) v1(55.2,45.66) v1(55.21,44.13) v1(55.35,0.55) v1(55.8,44.89) v1(56.43,44.13) v1(56.47,14.78) v1(56.47,11.05) v1(56.47,7.33) v1(56.47,3.61) v1(56.66,52.56) v1(57.53,15.88) v1(57.68,52.56) v1(57.66,41.61) v1(57.66,40.63) v1(57.66,39.66) v1(57.66,38.69) v1(57.66,37.72) v1(57.8,46.89) v1(58.23,55.64) v1(58.17,42.13) v1(58.17,41.17) v1(58.17,40.21) v1(58.17,39.25) v1(58.17,38.3) v1(58.54,47.71) v1(58.76,15.88) v1(58.87,59.36) v1(58.85,52.56) v1(59.07,0.55) v1(59.16,49.44) v1(59.16,48.19) v1(59.94,52.56) v1(59.93,50.16) v1(60.07,45.98) v1(60.19,14.78) v1(60.19,11.05) v1(60.19,7.33) v1(60.19,3.61) v1(61.06,15.88) v1(61.24,50.16) v1(61.7,48.11) v1(61.87,26.16) v1(62.28,15.88) v1(62.4,50.19) v1(62.8,0.55) v1(63.04,44.46) v1(63.04,40.73) v1(63.74,50.32) v1(63.91,14.78) v1(63.91,11.05) v1(63.91,7.33) v1(64.14,59.36) v1(64.82,50.77) v1(65.31,52.02) v1(65.67,25.74) v1(65.67,22.01) v1(66.21,42.48) v1(67.26,15.88) v1(67.64,14.78) v1(67.64,11.05) v1(67.64,7.33) v1(68.48,15.88) v1(69.41,59.36) v1(69.4,53.93) v1(69.4,50.21) v1(69.4,44.36) v1(69.4,40.63) v1(69.4,36.91) v1(69.4,33.18) v1(69.4,29.46) v1(69.4,25.74) v1(69.4,22.01) v1(69.4,18.29) v1(69.4,14.56) v1(69.4,10.84) v1(69.4,7.11)
VBUS_CON: length 20
  Top Layer w0.203: D5.5 35.51,10.32 v1(35.5,10.31)
  Top Layer w0.254: J10.B4A9 37.4,5.91 37.17,5.69 ; 32.83,5.73 32.81,5.73 32.6,5.94 J10.A4B9
  Top Layer w0.381: 32.83,5.73 32.86,5.69
  Top Layer w0.508: J10.B4A9 37.43,6.71 v1(37.43,7.97) v1(37.43,8.58) ; 37.17,5.69 37.01,5.53 37.01,5.2 36.36,4.54 33.59,4.54 32.86,5.27 32.86,5.69 ; J10.A4B9 32.6,7.84 ; v1(32.6,7.84) 32.6,8.45 v1(32.59,8.46) 29.21,8.46 D6.1
  Bottom Layer w0.508: v1(35.5,10.31) 36.15,10.31 37.43,9.03 v1(37.43,8.58) v1(37.43,7.97)
ACTA: length 8.3
  Top Layer w0.106: U1.15 17.72,29.84 17.91,29.65 17.91,28.18 18.94,27.16 18.94,24.91 R2.1
ACTB: length 8.5
  Top Layer w0.106: U2.15 39.21,29.84 39.32,29.73 39.32,28.34 40.03,27.62 40.03,24.93 39.68,24.57 38.2,24.57 37.76,24.13 R7.1
ACTC: length 7.8
  Top Layer w0.106: R12.1 60.73,24.62 60.73,29.53 60.41,29.84 U3.15
ACTNA: length 1.7
  Top Layer w0.106: 16.27,23.26 14.62,23.26
ACTnB: length 1.5
  Top Layer w0.106: R7.2 D2.2
ACTnC: length 1.5
  Top Layer w0.106: D3.2 58.35,23.26
ANT1A: length 1.4
  Top Layer w0.106: L1.1 13.87,36.16 U1.34
ANT1B: length 1.4
  Top Layer w0.106: L10.1 35.36,36.15 U2.34
ANT1C: length 1.5
  Top Layer w0.106: L19.1 U3.34
ANT2A: length 1.1
  Top Layer w0.106: L2.1 L1.2
ANT2B: length 1.1
  Top Layer w0.106: L11.1 35.3,36.78
ANT2C: length 1.1
  Top Layer w0.106: L20.1 56.5,36.89
ANT3A: length 1.1
  Top Layer w0.106: L2.2 13.84,38.42 L3.1
ANT3B: length 1.1
  Top Layer w0.102: L11.2 35.31,38.42 L12.1
ANT3C: length 1.1
  Top Layer w0.106: 56.5,38.52 56.51,38.53 56.51,39.58
ANT4A: length 3
  Top Layer w0.106: 13.89,40.75 13.09,41.55 C4.1 ; 13.89,40.75 C3.1 13.89,40.08 L3.2 ; 13.89,40.75 13.89,41.62
ANT4B: length 2.9
  Top Layer w0.106: 35.25,40.98 C23.1 35.25,40.09 L12.2 ; 35.25,40.98 34.68,41.55 C24.1 ; 35.25,40.98 35.25,41.66
ANT4C: length 2.8
  Top Layer w0.106: 56.51,40.98 56.51,41.67 ; 56.51,40.98 55.94,41.55 C44.1 ; 56.51,40.98 56.51,40.15
ANTSELA: length 17.2
  Top Layer w0.106: v1(10.23,31.1) 10.35,31.1 10.69,31.44 U1.47 ; v1(10.44,43.36) 10.44,43.68 10.67,43.92 U4.8
  Bottom Layer w0.106: v1(10.23,31.1) 10.03,31.31 10.03,35.02 8.2,36.84 8.2,42.36 9.2,43.36 v1(10.44,43.36)
ANTSELB: length 27
  Top Layer w0.106: v1(31.72,30.66) 31.75,30.66 31.95,30.85 31.95,31.11 32.28,31.44 U2.47 ; U5.8 v1(31.81,43.92)
  Bottom Layer w0.106: v1(31.81,43.92) 29.61,41.71 29.61,36.5 31.33,34.78 31.33,33.82 32.5,32.64 32.5,35.89 32.33,36.06 32.33,36.42 32.58,36.68 32.94,36.68 33.2,36.42 33.2,32.36 31.72,30.88 v1(31.72,30.66)
ANTSELC: length 16.2
  Top Layer w0.106: U3.47 53.28,31.44 v1(53.05,31.21) ; U6.8 v1(53.09,43.92)
  Bottom Layer w0.106: v1(53.05,31.21) 52.43,31.83 52.43,35.48 50.91,37 50.91,41.74 v1(53.09,43.92)
BOOTA: length 17.9
  Top Layer w0.106: U1.16 17.69,30.24 18.17,29.76 18.17,28.29 19.96,26.5 R3.2 19.96,21.83 18.9,20.77 SW1.1
BOOTB: length 17.8
  Top Layer w0.106: SW3.1 48.22,20.55 42.45,20.55 SW3.1 42.24,22.24 40.45,24.02 R8.2 40.16,24.69 40.29,24.82 40.29,27.73 39.58,28.44 39.58,29.84 39.17,30.24 U2.16
BOOTC: length 16.8
  Top Layer w0.106: U3.16 60.38,30.24 60.98,29.64 60.98,24.87 61.74,24.11 R13.2 61.68,23.2 SW5.1 SW5.1
CC1: length 4.7
  Top Layer w0.254: R16.1 33.63,11.33 D7.1 33.75,9.58 J10.A5
CC2: length 4.8
  Top Layer w0.254: R17.1 37.13,11.31 D8.1 36.75,9.34 J10.B5
CSNA: length 14
  Top Layer w0.106: U1.27 16.67,35.46 16.77,35.55 17.93,35.55 18.78,36.4 18.78,42.56 16.12,45.22 U4.15
CSNB: length 14.2
  Top Layer w0.106: U2.27 38.16,35.4 38.3,35.54 39.35,35.54 40.51,36.7 40.51,42.19 37.48,45.22 U5.15
CSNC: length 14.2
  Top Layer w0.106: U3.27 59.3,35.33 59.83,35.86 60.75,35.86 61.69,36.8 61.69,42.39 58.86,45.22 U6.15
DCCA: length 1.7
  Top Layer w0.106: U1.43 10.48,33.04 10.31,32.88 L8.1
DCCB: length 2
  Top Layer w0.106: U2.43 32.16,33.04 31.64,32.52 L17.1
DCCC: length 2.1
  Top Layer w0.106: U3.43 52.06,33.04 L26.1
DECAA: length 8.4
  Top Layer w0.106: 11.02,36.73 11.02,36.73 11.21,36.54 v1(11.21,36.29) ; FB1.2 C12.1 ; U1.46 10.5,31.84 v1(10.5,31.84) 10.3,31.84 9.8,31.35 9.8,31.02 9.65,30.86 9.33,30.86
  Bottom Layer w0.106: v1(10.5,31.84) 11.21,32.55 v1(11.21,36.29)
DECAB: length 9.5
  Top Layer w0.106: FB4.1 32.51,36.75 32.76,36.49 v1(32.76,36.24) ; C32.1 FB3.2 30.97,30.51 31.08,30.62 31.08,30.99 31.37,31.28 v1(31.51,31.28) 32.07,31.84 U2.46
  Bottom Layer w0.106: v1(32.76,36.24) 32.76,32.54 v1(31.51,31.28)
DECAC: length 8.3
  Top Layer w0.106: FB5.2 C52.1 ; FB5.2 52.08,30.9 52.09,30.91 ; FB5.2 52.09,30.86 52.09,30.91 ; 52.09,30.91 52.13,30.91 v1(53.13,31.91) 53.52,31.91 53.59,31.84 U3.46 ; 53.72,36.85 53.88,36.69 v1(53.88,36.35)
  Bottom Layer w0.106: v1(53.88,36.35) 53.88,32.66 v1(53.13,31.91)
DECDA: length 5
  Top Layer w0.254: U1.44 10.57,32.64 10.06,32.13 9.7,32.13 C11.1 ; C11.1 9.3,31.51 8.76,30.97 FB1.1 ; C11.1 9.3,31.87 L8.2
DECDB: length 5.3
  Top Layer w0.254: U2.44 32.33,32.64 31.53,31.84 31.08,31.84 30.74,31.51 ; FB3.1 30.16,30.67 30.74,31.25 C31.1 30.74,31.51 ; 30.74,31.51 30.74,31.56 29.78,32.52 L17.2
DECDC: length 5.7
  Top Layer w0.254: L26.2 51.28,32.14 51.81,32.14 51.96,31.99 C51.1 52.32,31.64 52.41,31.73 52.41,32.1 52.94,32.64 U3.44 ; FB5.1 51.51,30.97 51.96,31.42 51.96,31.58
DECMIDA: length 1.7
  Top Layer w0.254: L9.1 12.13,36.18 C14.1 ; 11.59,36.73 11.59,36.74 C13.2
DECMIDB: length 1.7
  Top Layer w0.254: 33.63,36.75 33.08,36.75 FB4.2 ; 33.63,36.75 33.63,37.31 ; 33.63,36.75 33.63,36.18 ; 33.63,36.75 C33.2
DECMIDC: length 1.7
  Top Layer w0.254: C53.2 54.83,37.41 ; C53.2 54.29,36.85 ; C53.2 L27.1
DECRFA: length 2.1
  Top Layer w0.203: U1.36 13.07,35.81
  Top Layer w0.254: C13.1 12.69,36.19 L9.2 13.07,35.81
DECRFB: length 2.1
  Top Layer w0.203: U2.36 34.56,35.82 L18.2
  Top Layer w0.254: C33.1 34.21,36.18 L18.2
DECRFC: length 2.2
  Top Layer w0.203: 55.7,34.81 55.7,35.43 55.4,35.73 C53.1
DECUSBA: length 2.9
  Top Layer w0.106: U1.18 18.13,31.04 18.35,30.83 18.58,30.83 19.55,29.86 C15.1
DECUSBB: length 2.7
  Top Layer w0.106: C35.1 40.91,29.81 39.67,31.04 U2.18
DECUSBC: length 2.4
  Top Layer w0.106: U3.18 60.66,31.04 60.87,30.83 61.53,30.83 C55.1
FANT1A: length 1.7
  Top Layer w0.106: L4.1 13.84,47.64 arc(13.6,47.29) U4.2
FANT1B: length 1.7
  Top Layer w0.106: L13.1 35.2,47.64 arc(34.97,47.29) U5.2
FANT1C: length 1.7
  Top Layer w0.106: L22.1 56.44,47.64 arc(56.21,47.29) U6.2
FANT2A: length 1.7
  Top Layer w0.106: L6.1 12.55,47.64 arc(12.79,47.29) U4.3
FANT2B: length 1.7
  Top Layer w0.106: L15.1 33.92,47.64 arc(34.15,47.29) U5.3
FANT2C: length 1.7
  Top Layer w0.106: L24.1 55.15,47.64 arc(55.39,47.29) U6.3
FMID1A: length 1.2
  Top Layer w0.106: C7.2 14.42,48.77 L4.2 14.41,49.41
FMID1B: length 1.2
  Top Layer w0.106: C27.2 35.78,48.77 L13.2 35.77,49.41
FMID1C: length 1.2
  Top Layer w0.106: L22.2 57.01,49.41 ; C47.2 57.02,48.77
FMID2A: length 1.2
  Top Layer w0.106: C9.2 11.97,48.77 L6.2 11.98,49.41
FMID2B: length 1.2
  Top Layer w0.106: C29.2 33.34,48.77 L15.2 33.35,49.41
FMID2C: length 1.2
  Top Layer w0.106: 54.58,49.41 L24.2 54.57,48.77 C49.2
FMODEA: length 1.8
  Top Layer w0.106: R1.2 11.89,47.71 12.22,47.38 U4.4
FMODEB: length 2.3
  Top Layer w0.152: U5.4 33.59,47.14 33.43,47.29 R6.2
FMODEC: length 2.3
  Top Layer w0.152: R11.2 54.7,47.29 54.82,47.17 U6.4
HUB_V33: length 11.6
  Top Layer w0.254: U7.20 34.24,16.85 v1(34.24,16.21) ; U7.1 v1(37.75,17.61)
  Top Layer w0.28: C61.1 32.52,18.61 U7.16
  Top Layer w0.508: v1(31.05,17.76) 31.21,17.92 C61.1
  Bottom Layer w0.762: v1(31.05,17.76) 32.12,17.76 33.68,16.21 v1(34.24,16.21) 36.35,16.21 v1(37.75,17.61)
MISOA: length 12.8
  Top Layer w0.106: U4.14 v1(15.92,44.57) ; U1.30 15.47,35.85 16.66,37.05 v1(17.6,37.05)
  Bottom Layer w0.106: v1(17.6,37.05) 17.29,37.05 16.33,38 16.33,44.16 v1(15.92,44.57)
MISOB: length 11.8
  Top Layer w0.106: U2.30 36.96,35.78 38.24,37.06 v1(38.54,37.06) ; U5.14 v1(37.2,44.57)
  Bottom Layer w0.106: v1(37.2,44.57) 37.76,44 37.76,37.78 38.49,37.06 v1(38.54,37.06)
MISOC: length 11.4
  Top Layer w0.106: U6.14 v1(58.49,44.57) ; U3.30 58.1,36.08 58.83,36.81 v1(59.14,36.81)
  Bottom Layer w0.106: v1(58.49,44.57) 58.97,44.09 58.97,36.98 v1(59.14,36.81)
MODEA: length 21.6
  Top Layer w0.106: U1.48 11.3,31.05 10.79,31.05 10.24,30.5 v1(10.24,30.29) ; R1.1 v1(10.1,47.71)
  Bottom Layer w0.106: v1(10.24,30.29) 9.77,30.77 9.77,34.91 7.94,36.73 7.94,42.47 9.13,43.66 9.79,43.66 10.02,43.89 10.02,47.62 v1(10.1,47.71)
MODEB: length 21.2
  Top Layer w0.106: R6.1 v1(30.49,47.29) ; U2.48 32.31,31.04 32.21,30.93 32.21,30.48 31.74,30.01 v1(31.49,30.01)
  Bottom Layer w0.106: v1(31.49,30.01) 31.49,30.2 31.05,30.64 31.05,34.69 29.35,36.39 29.35,41.82 30.49,42.96 v1(30.49,47.29)
MODEC: length 20
  Top Layer w0.106: v1(53.17,30.47) 53.17,30.72 53.49,31.04 U3.48 ; v1(51.76,47.31) 51.78,47.29 R11.1
  Bottom Layer w0.106: v1(51.76,47.31) 51.76,42.96 50.65,41.85 50.65,36.89 52.17,35.37 52.17,31.47 v1(53.17,30.47)
MOSIA: length 11.9
  Top Layer w0.106: U4.13 v1(15.82,43.92) ; v1(17.59,36.38) 16.44,36.38 15.87,35.81 U1.29
  Bottom Layer w0.106: v1(17.59,36.38) 16.07,37.9 16.07,43.67 v1(15.82,43.92)
MOSIB: length 11.1
  Top Layer w0.106: U2.29 37.36,35.81 37.94,36.39 v1(38.52,36.39) ; U5.13 37.1,43.92 v1(37.26,43.76)
  Bottom Layer w0.106: v1(38.52,36.39) 37.51,37.41 37.51,43.52 v1(37.26,43.76)
MOSIC: length 10.6
  Top Layer w0.106: v1(58.51,43.91) 58.51,43.92 U6.13 ; v1(59.13,36.14) 58.76,36.14 58.5,35.88 U3.29
  Bottom Layer w0.106: v1(59.13,36.14) 59.04,36.14 58.71,36.47 58.71,43.72 v1(58.51,43.91)
NRSTA: length 38.3
  Top Layer w0.106: 14.27,34.8 14.27,36.33 17.91,39.97 ; 9.12,20.77 9.49,20.77 10.84,22.12 10.84,23.26
  Sig.Mid1 w0.117: 17.91,39.97 16.83,38.9 16.83,23.69 16.41,23.27 11.48,23.27
  Bottom Layer w0.106: 24.14,39.34 19.1,39.34 18.47,39.97
nRSTA: length 9
  Top Layer w0.106: R4.2 11.41,23.26 11.48,23.34 11.48,23.37 ; SW2.1 SW2.1
  Bottom Layer w0.106: 24.14,39.34 J3.9 ; 18.47,39.97 v1(17.91,39.97)
  vias: v1(11.48,23.27)
NRSTB: length 35.2
  Top Layer w0.106: 21.76,20.77 27.96,20.77 28.34,20.77 29.37,21.8 29.37,24.02 ; v1(39.6,40.01) 39.41,40.01 35.77,36.37 35.77,34.81
  Sig.Mid1 w0.117: 30.03,24.03 30.15,24.15 30.58,24.15 30.71,24.01 38.08,24.01 39.16,25.09 ; 39.16,39.57 v1(39.6,40.01)
  Bottom Layer w0.106: 46.68,40.41 45.62,39.35 40.56,39.35 39.91,40.01 v1(39.6,40.01)
nRSTB: length 15.1
  Top Layer w0.106: R9.2 29.38,24.03 v1(30.03,24.03)
  Sig.Mid1 w0.117: 39.16,25.09 39.16,39.57
NRSTC: length 47.8
  Top Layer w0.106: 52.07,23.26 51.4,23.26 51.4,22.72 51.96,22.15 51.96,20.77 52.23,20.49 57.89,20.49 58.16,20.77 ; 56.9,34.8 56.9,36.09 v1(60.82,40.01)
  Sig.Mid1 w0.117: 52.07,23.26 56.86,23.26 59.49,25.89 59.49,27.19 59,27.68 59,28.56 59.81,29.37 59.81,39 v1(60.82,40.01)
  Bottom Layer w0.106: 67.7,40.41 66.64,39.35 61.84,39.35 61.18,40.01 v1(60.82,40.01)
nRSTC:
  vias: v1(52.07,23.26)
PDNA: length 16.3
  Top Layer w0.106: v1(10.46,34.1) 10.72,33.84 U1.41 ; U4.11 v1(13.52,42.23)
  Bottom Layer w0.106: v1(10.46,34.1) 10.46,34.95 8.46,36.95 8.46,42.25 9.13,42.92 12.82,42.92 v1(13.52,42.23)
PDNB: length 16.2
  Top Layer w0.106: U5.11 34.88,42.21 v1(34.95,42.14) ; U2.41 32.08,33.84 v1(31.86,34.06)
  Bottom Layer w0.106: v1(34.95,42.14) 34.95,42.4 34.57,42.79 31.05,42.79 29.87,41.61 29.87,36.62 31.86,34.62 v1(31.86,34.06)
PDNC: length 15.7
  Top Layer w0.106: U6.11 56.12,42.56 v1(56.29,42.39) ; U3.41 53.43,33.84 53.11,34.16 v1(52.86,34.16)
  Bottom Layer w0.106: v1(52.86,34.16) 52.86,35.41 51.17,37.11 51.17,41.63 52.23,42.7 55.98,42.7 v1(56.29,42.39)
REQ_AB: length 30.8
  Top Layer w0.106: 37.76,28.88 37.76,27.79 38.02,27.54 38.02,25.19 v1(37.79,24.96) ; v1(15,25.55) 14.6,25.95 14.6,27.13 14.27,27.46 14.27,28.88
  Bottom Layer w0.106: v1(15,25.55) 15.26,25.28 37.14,25.28 37.46,24.96 v1(37.79,24.96)
REQ_BC: length 29.6
  Top Layer w0.106: U2.7 35.76,26.55 v1(35.73,26.52) ; v1(59.05,26.72) 59.03,26.74 59.03,27.64 58.9,27.77 U3.12
  Bottom Layer w0.106: v1(35.73,26.52) 35.9,26.69 52.09,26.69 53.96,24.82 57.29,24.82 59.05,26.57 v1(59.05,26.72)
REQ_CA: length 43.2
  Top Layer w0.106: U3.7 56.9,27.93 v1(56.85,27.88) ; v1(16.35,28.17) 16.27,28.25 U1.12
  Bottom Layer w0.106: v1(56.85,27.88) 54.69,27.88 53.55,29.02 30.14,29.02 29.11,28 16.52,28 v1(16.35,28.17)
RFO1A: length 9.6
  Top Layer w0.106: 14.41,50 C8.2 14.95,50.15 14.95,51.29 17.6,51.29 17.6,56.49
RFO1B: length 11.4
  Top Layer w0.106: 35.77,50 C28.2 36.31,51.46 40.8,51.46 40.8,56.49
RFO1C: length 13.4
  Top Layer w0.106: 64,56.49 64,51.4 57.55,51.4 C48.2 57.01,50
RFO2A: length 12.3
  Top Layer w0.106: 11.98,50 C10.2 11.4,50.19 11.4,51.22 6,51.22 6,56.49
RFO2B: length 10.5
  Top Layer w0.106: 29.2,56.49 29.2,51.51 32.82,51.51 C30.2 33.35,50
RFO2C: length 8.6
  Top Layer w0.106: 52.4,56.49 52.4,51.47 54.05,51.47 C50.2 54.58,50
RXENA: length 13.2
  Top Layer w0.106: U4.7 10.96,44.57 8.21,41.82 8.21,37.05 11.01,34.24 U1.40
RXENB: length 13.5
  Top Layer w0.106: U5.7 31.82,44.57 29.76,42.5 29.76,36.78 32.3,34.24 U2.40
RXENC: length 13.8
  Top Layer w0.106: U6.7 52.88,44.57 50.76,42.45 50.76,36.87 53.39,34.24 U3.40
SCKA: length 13.8
  Top Layer w0.106: U1.28 16.27,35.42 16.66,35.81 17.82,35.81 18.52,36.51 18.52,42.45 18.05,42.92 U4.12
SCKB: length 13.9
  Top Layer w0.106: U2.28 37.76,35.36 38.26,35.87 39.24,35.87 40.2,36.83 40.2,42.07 39.35,42.92 U5.12
SCKC: length 13.8
  Top Layer w0.106: U6.12 60.69,42.92 61.38,42.22 61.38,36.99 60.63,36.24 59.85,36.24 58.9,35.3 58.9,34.81 U3.28
SPI_AB_CS: length 31
  Top Layer w0.106: U1.5 13.47,28.2 12.74,27.48 R5.2 12.76,26.76 v1(13.39,26.76) ; U2.11 37.36,26.39 37.53,26.23 v1(37.53,25.65)
  Bottom Layer w0.106: v1(13.39,26.76) 14.4,26.76 15.62,25.54 37.42,25.54 v1(37.53,25.65)
SPI_AB_MISO: length 35.2
  Top Layer w0.106: v1(37.21,24.6) 37.21,25.34 36.96,25.59 U2.10 ; U1.4 13.07,28.17 11.79,26.89 11.79,26.13 11.35,25.69 v1(11.35,25.44)
  Bottom Layer w0.106: v1(37.21,24.6) 36.69,24.07 35.86,24.07 35.47,24.46 14.74,24.46 13.76,25.44 v1(11.35,25.44)
SPI_AB_MOSI: length 33
  Top Layer w0.106: U2.9 36.56,24.9 v1(36.61,24.85) ; U1.3 12.67,28.13 11.35,26.82 v1(11.35,26.31)
  Bottom Layer w0.106: v1(11.35,26.31) 13.63,26.31 14.91,25.03 36.43,25.03 v1(36.61,24.85)
SPI_AB_SCK: length 35.1
  Top Layer w0.106: U2.8 36.16,24.63 v1(36.04,24.51) ; v1(10.42,25.44) 10.56,25.44 10.86,25.73 10.86,26.69 12.27,28.1 U1.2
  Bottom Layer w0.106: v1(36.04,24.51) 35.81,24.74 14.83,24.74 13.7,25.87 10.86,25.87 v1(10.42,25.44)
SPI_BC_CS: length 37
  Top Layer w0.106: R10.2 32.08,26.39 v1(32.29,26.6) 33.68,26.6 33.94,26.86 33.94,27.31 34.96,28.34 U2.5 ; U3.11 58.5,27.56 v1(58.6,27.46)
  Bottom Layer w0.106: v1(32.29,26.6) 33.68,26.6 34.03,26.95 52.19,26.95 54.07,25.07 57.07,25.07 58.6,26.61 v1(58.6,27.46)
SPI_BC_MISO: length 30.6
  Top Layer w0.106: v1(58.1,26.72) U3.10 ; v1(33.5,27.04) 33.5,27.32 34.56,28.38 U2.4
  Bottom Layer w0.106: v1(58.1,26.72) 58.1,26.51 56.92,25.33 54.18,25.33 52.3,27.21 33.68,27.21 v1(33.5,27.04)
SPI_BC_MOSI: length 30.6
  Top Layer w0.106: U2.3 34.16,28.37 33.08,27.29 v1(32.9,27.29) ; U3.9 57.7,27.5 v1(57.67,27.46)
  Bottom Layer w0.106: v1(57.67,27.46) 57.67,26.53 56.73,25.59 54.28,25.59 52.41,27.47 33.07,27.47 v1(32.9,27.29)
SPI_BC_SCK: length 30.8
  Top Layer w0.106: v1(32.29,27.55) 32.89,28.15 33.57,28.15 33.76,28.34 U2.2 ; v1(57.21,26.72) 57.21,27.63 57.3,27.71 U3.8
  Bottom Layer w0.106: v1(32.29,27.55) 32.47,27.73 52.51,27.73 54.39,25.85 56.62,25.85 57.21,26.44 v1(57.21,26.72)
SPI_CA_CS: length 49.4
  Top Layer w0.106: U3.5 56.1,28.24 55.47,27.61 v1(55.47,27.37) 55.47,26.74 53.83,25.11 R15.2 ; v1(16.39,26.79) 15.87,27.31 U1.11
  Bottom Layer w0.106: v1(16.39,26.79) 16.59,26.59 28.8,26.59 30.46,28.25 52.73,28.25 54.04,26.94 55.04,26.94 v1(55.47,27.37)
SPI_CA_MISO: length 45.5
  Top Layer w0.106: v1(54.61,26.51) 55.03,26.92 55.03,27.64 55.7,28.31 U3.4 ; U1.10 15.47,28.33 15.61,28.19 15.61,26.93 v1(15.78,26.76)
  Bottom Layer w0.106: v1(15.78,26.76) 15.78,26.62 16.08,26.33 28.91,26.33 30.57,27.99 52.62,27.99 54.1,26.51 v1(54.61,26.51)
SPI_CA_MOSI: length 43.4
  Top Layer w0.106: U1.9 15.07,28.12 v1(15.15,28.04) ; v1(54.6,27.37) 54.6,27.58 55.3,28.29 U3.3
  Bottom Layer w0.106: v1(15.15,28.04) 15.45,27.74 29.22,27.74 30.25,28.77 53.44,28.77 54.6,27.61 v1(54.6,27.37)
SPI_CA_SCK: length 43.1
  Top Layer w0.106: v1(53.79,27.8) 54.42,27.8 54.9,28.29 U3.2 ; U1.8 14.67,27.78 v1(15.17,27.28)
  Bottom Layer w0.106: v1(15.17,27.28) 15.37,27.48 29.33,27.48 30.35,28.51 53.08,28.51 v1(53.79,27.8)
SWCLKA: length 14.1
  Top Layer w0.106: U1.31 15.07,36.4 17.36,38.69 v1(17.91,38.69)
  Bottom Layer w0.106: J3.5 23.86,36.67 20.76,36.67 18.73,38.69 v1(17.91,38.69)
SWCLKB: length 13.9
  Top Layer w0.106: U2.31 36.56,36.28 39.01,38.73 v1(39.6,38.73)
  Bottom Layer w0.106: 39.68,38.73 41.79,38.73 43.7,36.81 45.19,36.81 J6.5
SWCLKC: length 13.8
  Top Layer w0.106: v1(60.86,38.73) 60.27,38.73 57.7,36.16 U3.31
  Bottom Layer w0.106: v1(60.86,38.73) 62.68,38.73 64.81,36.6 66.3,36.6 67.57,35.33 J9.5
SWDIOA: length 14
  Top Layer w0.106: v1(17.91,39.35) 17.65,39.35 14.67,36.37 U1.32
  Bottom Layer w0.106: v1(17.91,39.35) 18.73,39.35 19,39.08 24.14,39.08 25.2,38.02 J3.7
SWDIOB: length 13.9
  Top Layer w0.106: U2.32 36.16,36.24 39.3,39.39 v1(39.6,39.39)
  Bottom Layer w0.106: J6.7 45.45,39.09 40.45,39.09 40.16,39.39 v1(39.6,39.39)
SWDIOC: length 13.7
  Top Layer w0.106: U3.32 57.3,36.13 60.56,39.39 v1(60.83,39.39)
  Bottom Layer w0.106: J9.7 66.47,39.09 61.73,39.09 61.44,39.39 v1(60.83,39.39)
SYNC: length 68.8
  Top Layer w0.254: v1(31.26,25.98) 31.7,26.42 31.7,27.93 32.65,28.88 U2.1 ; R19.2 48.32,13.59 49.64,14.91 v1(49.64,26.26) 50.96,26.26 53.58,28.88 U3.1 ; U1.1 11.35,28.88 10.42,27.94 v1(10.42,26.31)
  Bottom Layer w0.254: v1(10.42,26.31) 10.42,26.45 11.24,27.27 14.36,27.27 15.66,25.98 v1(31.26,25.98) 35.91,25.98 36.19,26.26 v1(49.64,26.26)
